# Altium schematic sheet 24V0.5A.SchDoc
size A4; SheetNumber: 1; SheetTotal: 1
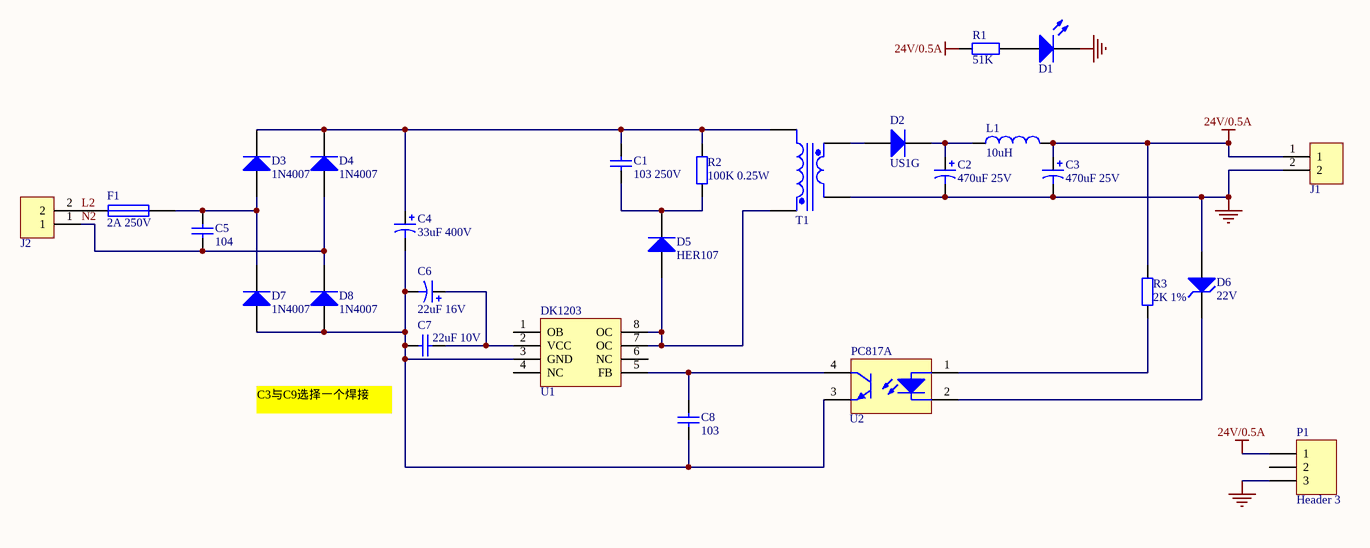
[diagram p0: 24V0.5A.SchDoc]

## Parts
C1  103 250V  [CAP_0805]
C2  470uF 25V  [CAP POLL 直插电解质8*12/8*16]
C3  470uF 25V  [CAP POLL 直插电解质8*12/8*16]
C4  33uF 400V  [Cap POLL 直插电解质 13*20]
C5  104  [Cap安规104]
C6  22uF 16V  [CAP POLL 直插电解质5*12]
C7  22uF 10V  [CAP_0805]
C8  103  [CAP瓷片直插]
D1  LED_  [LED_0805]  (value not drawn)
D2  US1G  [DIO_214]
D3  1N4007  [直插二极管]
D4  1N4007  [直插二极管]
D5  HER107  [DO-41]
D6  22V  [LL-34]
D7  1N4007  [直插二极管]
D8  1N4007  [直插二极管]
F1  I hold: 2A 250V  [2410]  (hidden comment: Fuse)
J1  接线端子2P  [接线端子2P]  (value not drawn)
J2  接线端子2P  [接线端子2P]  (value not drawn)
L1  value 10uH  [Inductor_SM4532]  (hidden comment: Inductor_)
P1  Header 3  [HDR1X3]
R1  51K  [Res_0805]
R2  100K 0.25W  [1206]
R3  2K 1%  [Res_0805]
T1  变压器-双边-8引脚  [变压器EE20-5_5-剪脚]  (value not drawn)
U1  DK1203  [DIP-8]
U2  PC817A  [DIP-4]

## Nets
24V/0.5A: C3.1 J1.1 L1.2 P1.1 R1.2 R3.2
GND2: C2.2 C3.2 D1.2(K) D6.1(A) J1.2 P1.3 T1.6(Sec-)
L2: F1.1 J2.2
N2: C5.1 D4.1(A) D8.2(K) J2.1
NetC1_1: C1.1 D5.2(K) R2.1
NetC1_2: C1.2 C4.1 D3.2(K) D4.2(K) R2.2 T1.1(Pri+)
NetC2_1: C2.1 D2.2(K) L1.1
NetC4_2: C4.2 C6.2 C7.2 C8.1 D7.1(A) D8.1(A) U1.3(GND) U2.3(E)
NetC5_2: C5.2 D3.1(A) D7.2(K) F1.2
NetC6_1: C6.1 C7.1 U1.2(VCC)
NetC8_2: C8.2 U1.5(FB) U2.4(C)
NetD1_1: D1.1(A) R1.1
NetD2_1: D2.1(A) T1.7(Sec+)
NetD5_1: D5.1(A) T1.4(Pri-) U1.7(OC) U1.8(OC)
NetD6_2: D6.2(K) U2.2(K)
NetR3_1: R3.1 U2.1(A)

Not connected (* = marked no-connect by the designer): P1 2; U1 1(OB) 4(NC) 6(NC)

## Notes on the sheet
- (near C7) C3与C9选择一个焊接

## Library data of the parts
C1 C5 C7 C8 = Cap_2
  C1: Value: 103 250V
  C5: Value: 104
  C7: Value: 22uF 10V
  C8: Value: 103
C2-C4 C6 = Cap_
  C2 C3: Value: 470uF 25V
  C4: Value: 33uF 400V
  C6: Value: 22uF 16V
D2 D5 = 1N4007
D6 = 稳压二极管: Value: 22V
P1 = Header 3: Header, 3-Pin; LatestRevisionDate: 17-Jul-2002; LatestRevisionNote: Re-released for DXP Platform.; Publisher: Altium Limited
R1-R3 = Res_
  R1: Value: 51K
  R2: Value: 100K 0.25W
  R3: Value: 2K 1%
U2 = 光耦 - 1